# Altium project Tesis.PrjPcb
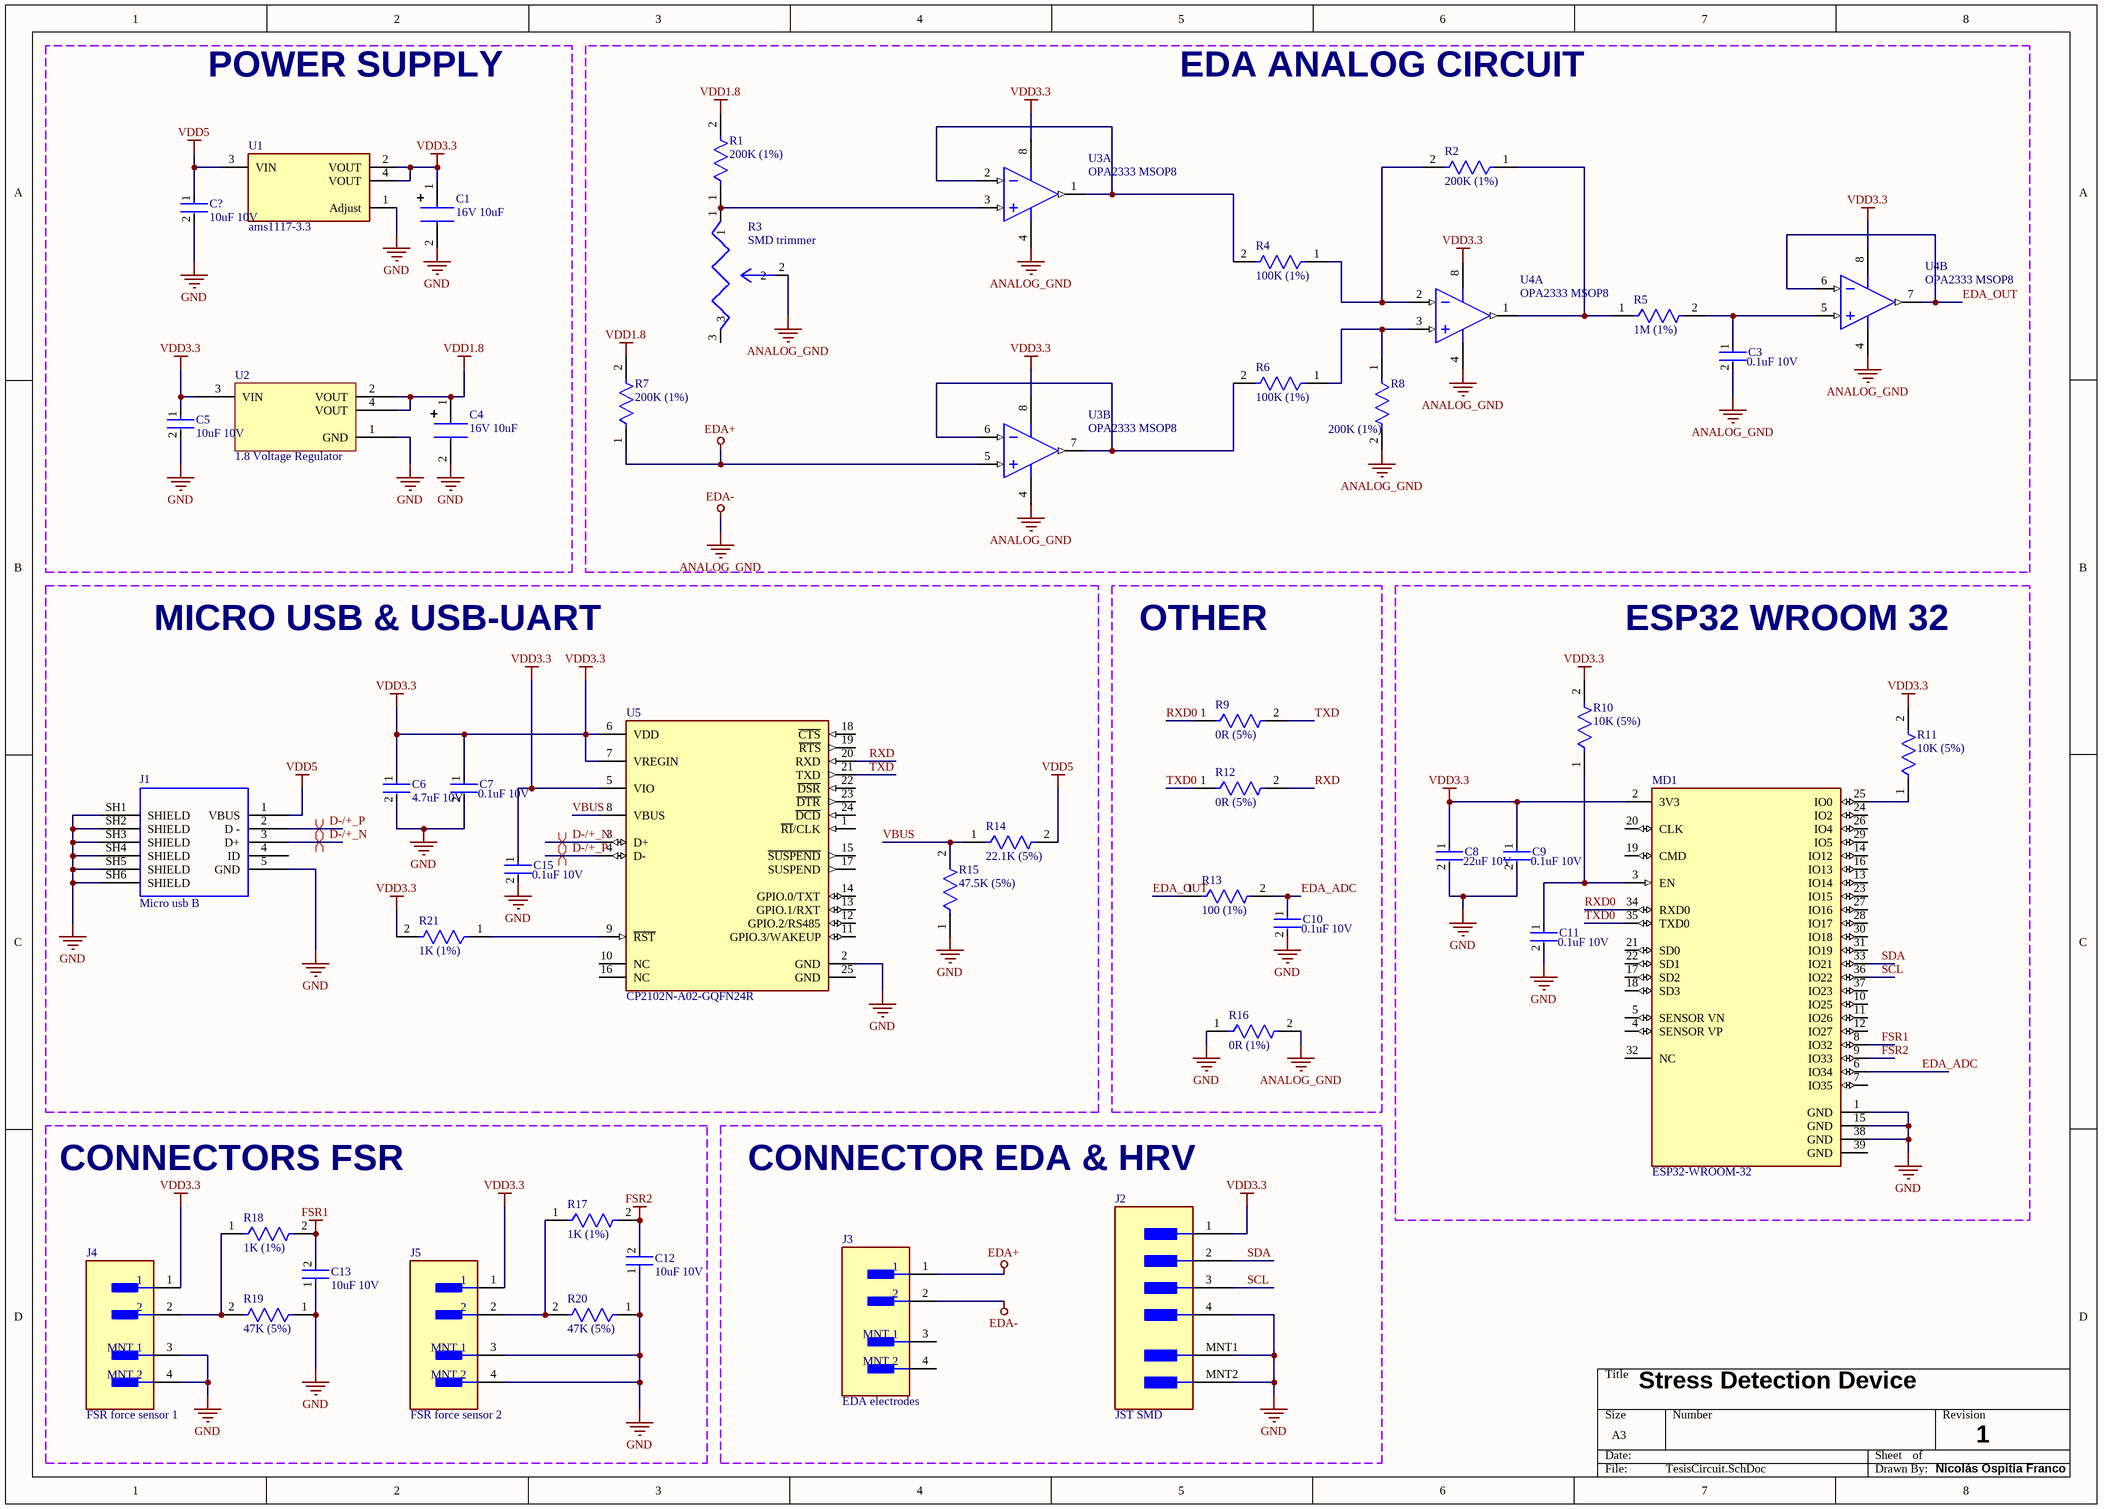
[diagram p0: TesisCircuit.SchDoc]
1 sheet, 46 parts. Net scope: global (net labels, ports and power ports of the same name join across sheets).
Board file: TesisCircuit.PcbDoc

## Sheet TesisCircuit.SchDoc
size A3; SheetNumber: 1; SheetTotal: 1

### Parts
C1  16V 10uF  [Tantalum Capacitor SMD]
C3  0.1uF 10V  [FP-1206Q-IPC_B]
C4  16V 10uF  [Tantalum Capacitor SMD]
C5  10uF 10V  [FP-1206Q-IPC_B]
C6  4.7uF 10V  [FP-1206Q-IPC_B]
C7  0.1uF 10V  [FP-1206Q-IPC_B]
C8  22uF 10V  [FP-1206Q-IPC_B]
C9  0.1uF 10V  [FP-1206Q-IPC_B]
C10  0.1uF 10V  [FP-1206Q-IPC_B]
C11  0.1uF 10V  [FP-1206Q-IPC_B]
C12  10uF 10V  [FP-1206Q-IPC_B]
C13  10uF 10V  [FP-1206Q-IPC_B]
C15  0.1uF 10V  [FP-1206Q-IPC_B]
C?  10uF 10V  [FP-1206Q-IPC_B]
J1  Micro usb B  [Micro Usb B]
J2  JST SMD  [4pin Connector JST-GH]
J3  EDA electrodes  [FP-SM02B-GHS-TB_LF_SN-MFG]
J4  FSR force sensor 1  [FP-SM02B-GHS-TB_LF_SN-MFG]
J5  FSR force sensor 2  [FP-SM02B-GHS-TB_LF_SN-MFG]
MD1  ESP32-WROOM-32  [FP-ESP32-WROOM-32-MFG]
R1  200K (1%)  [FP-CRCW0805-Ce3-IPC_B]
R2  200K (1%)  [FP-CRCW0805-Ce3-IPC_B]
R3  SMD trimmer  [SMD trimmer VG039NCHXT]
R4  100K (1%)  [FP-CRCW0805-Ce3-IPC_B]
R5  1M (1%)  [FP-CRCW0805-Ce3-IPC_B]
R6  100K (1%)  [FP-CRCW0805-Ce3-IPC_B]
R7  200K (1%)  [FP-CRCW0805-Ce3-IPC_B]
R8  200K (1%)  [FP-CRCW0805-Ce3-IPC_B]
R9  0R (5%)  [FP-CRCW0805-Ce3-IPC_B]
R10  10K (5%)  [FP-CRCW0805-Ce3-IPC_B]
R11  10K (5%)  [FP-CRCW0805-Ce3-IPC_B]
R12  0R (5%)  [FP-CRCW0805-Ce3-IPC_B]
R13  100 (1%)  [FP-CRCW0805-Ce3-IPC_B]
R14  22.1K (5%)  [FP-CRCW0805-Ce3-IPC_B]
R15  47.5K (5%)  [FP-CRCW0805-Ce3-IPC_B]
R16  0R (1%)  [FP-CRCW0805-Ce3-IPC_B]
R17  1K (1%)  [FP-CRCW0805-Ce3-IPC_B]
R18  1K (1%)  [FP-CRCW0805-Ce3-IPC_B]
R19  47K (5%)  [FP-CRCW0805-Ce3-IPC_B]
R20  47K (5%)  [FP-CRCW0805-Ce3-IPC_B]
R21  1K (1%)  [FP-CRCW0805-Ce3-IPC_B]
U1  ams1117-3.3  [FP-ams1117-IPC_A]
U2  1.8 Voltage Regulator  [AMS1117-1.8]
U3  OPA2333 MSOP8  [DGK0008A_M]  (parts A,B of 2)
U4  OPA2333 MSOP8  [DGK0008A_M]  (parts A,B of 2)
U5  CP2102N-A02-GQFN24R  [FP-CP2102N-A02-GQFN24R-IPC_B]

### Blocks framed on the sheet
POWER SUPPLY: C1 C4 C5 C? U1 U2
EDA ANALOG CIRCUIT: C3 R1-R8 U3 U4
MICRO USB & USB-UART: C6 C7 C15 J1 R14 R15 R21 U5
OTHER: C10 R9 R12 R13 R16
ESP32 WROOM 32: C8 C9 C11 MD1 R10 R11
CONNECTORS FSR: C12 C13 J4 J5 R17-R20
CONNECTOR EDA & HRV: J2 J3

### Nets
ANALOG_GND: C3.2 J3.2 R3.2 R8.2 R16.2 U3.4(V-) U4.4(V-)  [also labelled EDA-]
EDA+: J3.1 R7.1 U3.5(IN_B+)
FSR1: C13.2 MD1.8(IO32) R18.2
FSR2: C12.2 MD1.9(IO33) R17.2
GND: C1.2(-) C4.2(-) C5.2 C6.2 C7.2 C8.2 C9.2 C10.2 C11.2 C12.1 C13.1 C15.2 C?.2 J1.5(GND) J1.SH1(SHIELD) J1.SH2(SHIELD) J1.SH3(SHIELD) J1.SH4(SHIELD) J1.SH5(SHIELD) J1.SH6(SHIELD) J2.4 J2.MNT1 J2.MNT2 J4.3(MNT_1) J4.4(MNT_2) J5.3(MNT_1) J5.4(MNT_2) MD1.1(GND) MD1.15(GND) MD1.38(GND) R15.1 R16.1 R19.1 R20.1 U1.1(Adjust) U2.1(GND) U5.2(GND)
VDD1.8: C4.1(+) R1.2 R7.2 U2.2(VOUT) U2.4(VOUT)
VDD3.3: C1.1(+) C5.1 C6.1 C7.1 C8.1 C9.1 C15.1 J2.1 J4.1 J5.1 MD1.2(3V3) R10.2 R11.2 R21.2 U1.2(VOUT) U1.4(VOUT) U2.3(VIN) U3.8(V+) U4.8(V+) U5.5(VIO) U5.6(VDD) U5.7(VREGIN)
VDD5: C?.1 J1.1(VBUS) R14.2 U1.3(VIN)
D-/+_N: J1.3(D+) U5.3(D+)
D-/+_P: J1.2(D_-) U5.4(D-)
EDA_ADC: C10.1 MD1.6(IO34) R13.2
EDA_OUT: R13.1 U4.6(IN_B-) U4.7(OUT_B)
RXD: R12.2 U5.20(RXD)
RXD0: MD1.34(RXD0) R9.1
SCL: J2.3 MD1.36(IO22)
SDA: J2.2 MD1.33(IO21)
TXD: R9.2 U5.21(TXD)
TXD0: MD1.35(TXD0) R12.1
VBUS: R14.1 R15.2 U5.8(VBUS)
NetC3_1: C3.1 R5.2 U4.5(IN_B+)
NetC11_1: C11.1 MD1.3(EN) R10.1
NetJ4_2: J4.2 R18.1 R19.2
NetJ5_2: J5.2 R17.1 R20.2
NetMD1_25: MD1.25(IO0) R11.1
NetR1_1: R1.1 R3.1 U3.3(IN_A+)
NetR2_1: R2.1 R5.1 U4.1(OUT_A)
NetR2_2: R2.2 R4.1 U4.2(IN_A-)
NetR4_2: R4.2 U3.1(OUT_A) U3.2(IN_A-)
NetR6_1: R6.1 R8.1 U4.3(IN_A+)
NetR6_2: R6.2 U3.6(IN_B-) U3.7(OUT_B)
NetR21_1: R21.1 U5.9(~{RST})

Not connected (* = marked no-connect by the designer): J1 4(ID); J3 3(MNT_1) 4(MNT_2); MD1 4(SENSOR_VP) 5(SENSOR_VN) 7(IO35) 10(IO25) 11(IO26) 12(IO27) 13(IO14) 14(IO12) 16(IO13) 17(SD2) 18(SD3) 19(CMD) 20(CLK) 21(SD0) 22(SD1) 23(IO15) 24(IO2) 26(IO4) 27(IO16) 28(IO17) 29(IO5) 30(IO18) 31(IO19) 32(NC) 37(IO23) 39(GND); R3 3; U5 1(~{RI}/CLK) 10(NC) 11(GPIO.3/WAKEUP) 12(GPIO.2/RS485) 13(GPIO.1/RXT) 14(GPIO.0/TXT) 15(~{SUSPEND}) 16(NC) 17(SUSPEND) 18(~{CTS}) 19(~{RTS}) 22(~{DSR}) 23(~{DTR}) 24(~{DCD}) 25(GND)

### Layout directives
differential pair: D-/+_N, D-/+_P

### Notes on the sheet
- Stress Detection Device
- 1
- Nicolás Ospitia Franco

### Library data of the parts
C1 C4 = Tantalum Capacitor SMD: CASE-A-3216-18 / T491A106K016AT
C3 C5-C7 C9-C13 C15 C? = CMP-04427-000069-1: SMD Package Type 1206; Dielectric: X7R; Capacitance: 22uF; Dissipation Factor: 5%; Tolerance: 10%; Depth: 1.6mm; REACH SVHC: No SVHC; Length: 3.2mm; Voltage Rating (DC): 10V; Width: 0.063inch; Case Code (Metric): 3216; Voltage: 10V; Mount: Surface Mount; Voltage Rating: 10V; Termination: SMD/SMT; Min Operating Temperature: -55°C; Series: -; Package Quantity: 2500; Max Operating Temperature: 125°C; Construction: Flat; RoHS Compliant: Yes; Thickness: 0.071inch; Contact Plating: Tin; Case Code (Imperial): 1206; Lead Free: Lead Free; Packaging: Cut Tape; Case/Package: 1206
C8 = CMP-04427-000069-1: SMD Package Type 1206; Dielectric: X7R; Dissipation Factor: 5%; Tolerance: 10%; Depth: 1.6mm; REACH SVHC: No SVHC; Length: 3.2mm; Voltage Rating (DC): 10V; Width: 0.063inch; Case Code (Metric): 3216; Capacitance: 22uF; Voltage: 10V; Mount: Surface Mount; Voltage Rating: 10V; Termination: SMD/SMT; Min Operating Temperature: -55°C; Series: -; Package Quantity: 2500; Max Operating Temperature: 125°C; Construction: Flat; RoHS Compliant: Yes; Thickness: 0.071inch; Contact Plating: Tin; Case Code (Imperial): 1206; Lead Free: Lead Free; Packaging: Cut Tape; Case/Package: 1206
J1 = Micro Usb connector: Surface Mount / https://www.snapeda.com/parts/47346-0001/Molex/view-part/
J2 = 4pin Connector JST-GH: CONN HEADER SMD R/A 4POS 1.25MM
J3-J5 = CMP-2000-07076-2: CONN HEADER SMD R/A 2POS 1.25MM; Voltage Rating: 50V; Number of Positions: 2; Pitch: 0.049inch; Current Rating: 1A; Connector Type: Outer Shroud Contact; Number of Rows: 1; Contact Material: Bronze; Termination: Solder; Color: Natural; Package Quantity: 2500; Mount: Surface Mount; Housing Color: Natural; Number of Contacts: 2; Packaging: Tape and Reel; Lead Free: Lead Free; Housing Material: Nylon; Orientation: Right Angle; Contact Type: Male Pin; Contact Plating: Tin; Series: GH; Fastening Type: Latch
MD1 = CMP-194065-000008-1: RX TXRX MOD WIFI SURFACE MOUNT; Frequency: 2.5GHz; Sensitivity: -98dBm; Operating Supply Voltage: 3.6V; Data Rate: 150Mbps; Weight: 0.088185oz; Package Quantity: 550; Min Operating Temperature: -40°C; Mount: Surface Mount; Max Operating Temperature: 85°C; Packaging: Cut Tape; Case/Package: SMD/SMT
R1 R2 R4-R21 = CMP-00030-87884303-1: SMD Package Type 805; Power Rating: 125mW; Resistance: 0Ω; Voltage Rating: 150V; Case/Package: 0805; NexarPartId: 87884303; Composition: Thick Film; Height: 600µm; Max Operating Temperature: 155°C; Min Operating Temperature: -55°C; RoHS: Compliant; Lead Free: Lead Free
R3 = SMD trimmer VG039NCHXT: VG039NCHXT B503
U1 = CMP-209535-000002-1: 1A LOW DROPOUT VOLTAGE REGULATOR; RoHS Compliant: Yes
U2 = AMS1117-1.8
U3 U4 = CMP-0272-01196-3: 17 uA, MicroPower, Precision, Zero Drift CMOS Operational Amplifier, 1.8 to 5.5 V, -40 to 125 degC, 8-pin SOP (DGK8), Green (RoHS & no Sb/Br); Manufacturer: Texas Instruments; PartNumber: OPA2333AIDGKR; CMRR(Min)(dB): 106; IIB(Max)(pA): 200; Slew Rate(Typ)(V/us): 0.16; Sub Family: Low Offset Voltage Amplifier (<=500uV), Low Power Amp (<=500uA), Low Supply Voltage Amplifier (<=2.7V), Precision Amplifier, Zero Drift Precision Amplifier; Total Supply Voltage(Min)(+5V is 5, +/-5V is 10): 1.8; Total Supply Voltage(Max)(+5V is 5, +/-5V is 10): 5.5; Offset Drift(Typ)(uV/C): 0.02; Number of Channels: 2; Iq per channel(Max)(mA): 0.025; Vio (25C)(Max)(mV): 0.01; PackageVersion: 4073329/E, 05/2006; ComponentLink3URL: http://www.ti.com/litv/pdf/mpds028d; Eco-Plan: Green (RoHS & no Sb/Br); ComponentLink2URL: http://www.ti.com/general/docs/lit/getliterature.tsp?genericPartNumber=OPA2333&fileType=pdf; Mounting Technology: Surface Mount; PackageDescription: 8-Pin Thin Small Outline, Body 3 x 3 mm, Pitch 0.65 mm; DatasheetVersion: SBOS351C; ComponentLink1Description: Manufacturer URL; Code_JEDEC: MO-187; ComponentLink3Description: Package Specification; ComponentLink1URL: http://www.ti.com/; ComponentLink2Description: Datasheet; PackageReference: DGK0008A
U5 = CMP-08107-000009-2: IC USB TO UART BRIDGE QFN24; Manufacturer Lifecycle Status: FULL PRODUCTION; NexarPartId: 99772192; Max Junction Temperature (Tj): 105°C; Min Supply Voltage: 1.71V; Max Supply Voltage: 3.6V; Number of Digital IO: 4; Interface: I2C, RS-485, UART, USB; Lifecycle Status: Production; Min Operating Temperature: -40°C; Height: 800µm; Ambient Temperature Range High: 85°C; Schedule B: 8542390000, 8542390000; Max Operating Temperature: 85°C